# Altium schematic sheet base.SchDoc: base
size 500 x 342 mm; Date: 2019/4/19 20:09:35; SheetNumber: 1
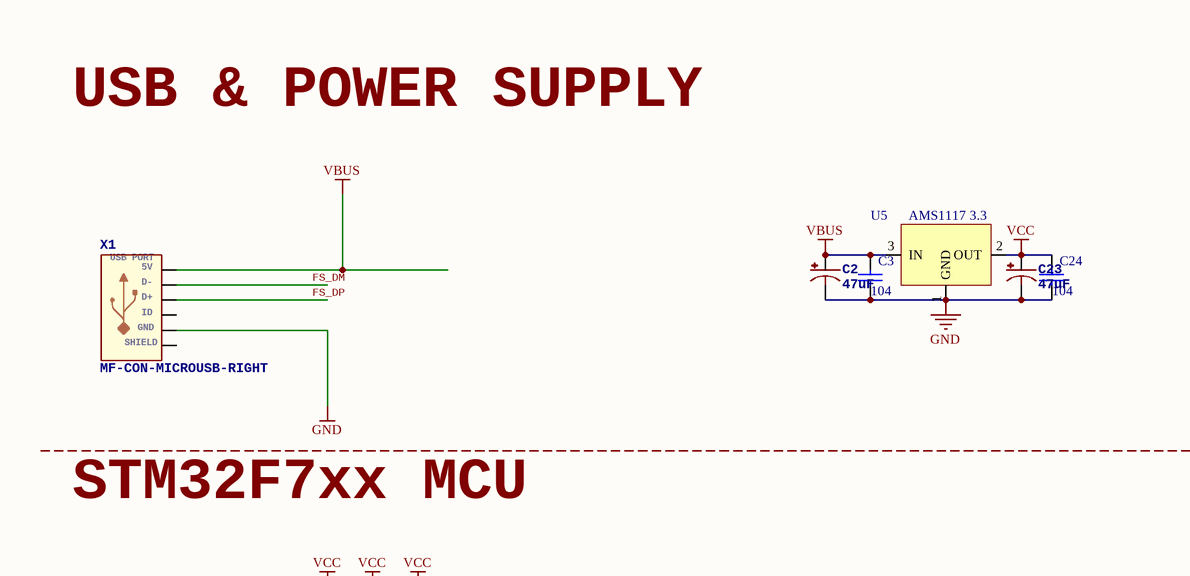
[diagram p0: base.SchDoc, top left]
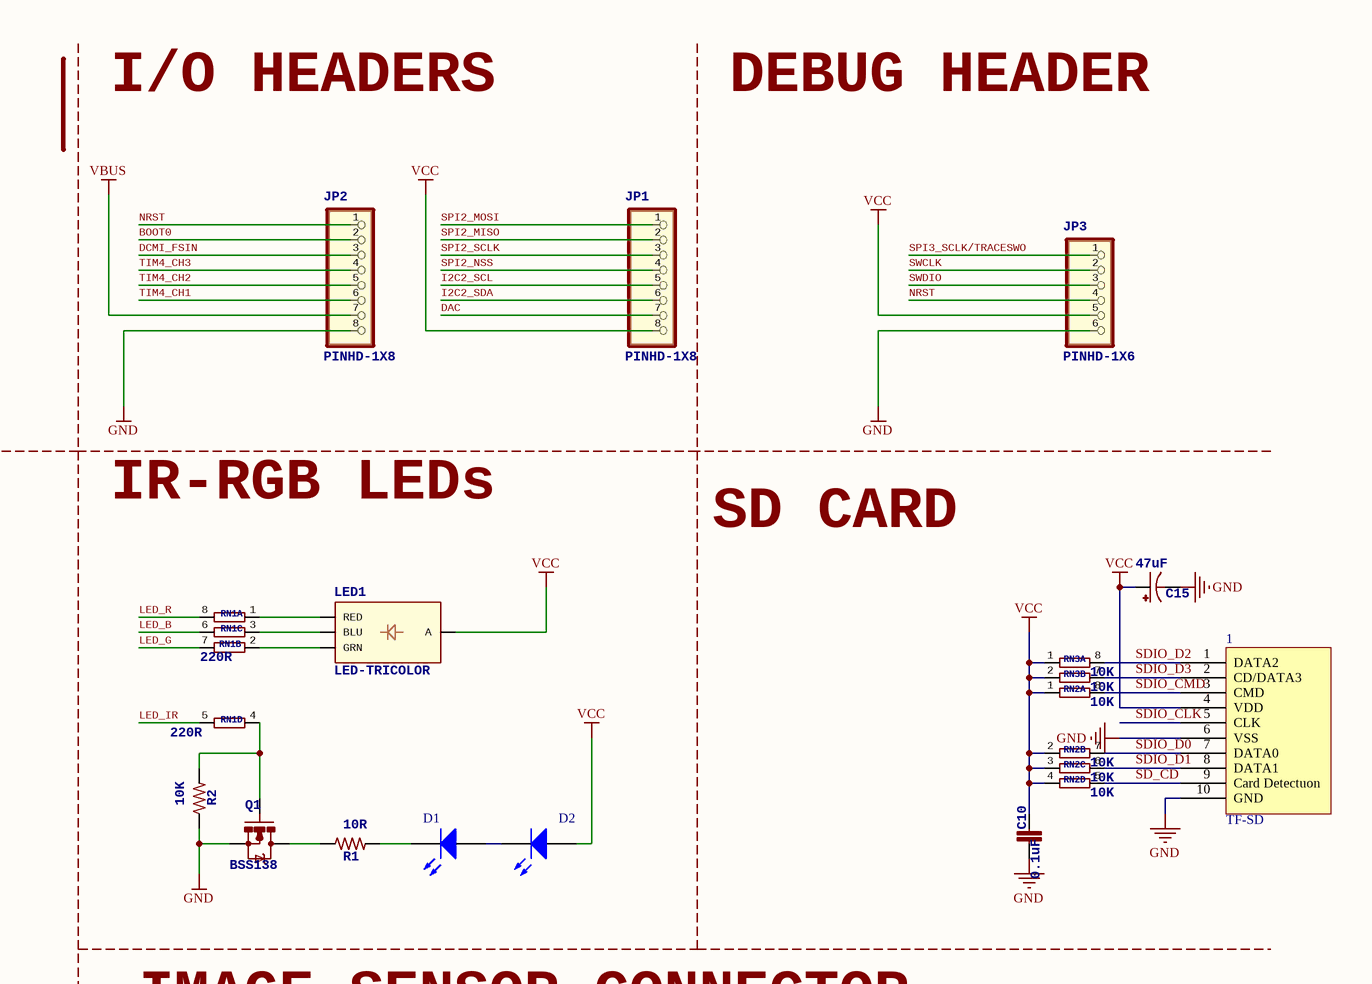
[diagram p1: base.SchDoc, top right]
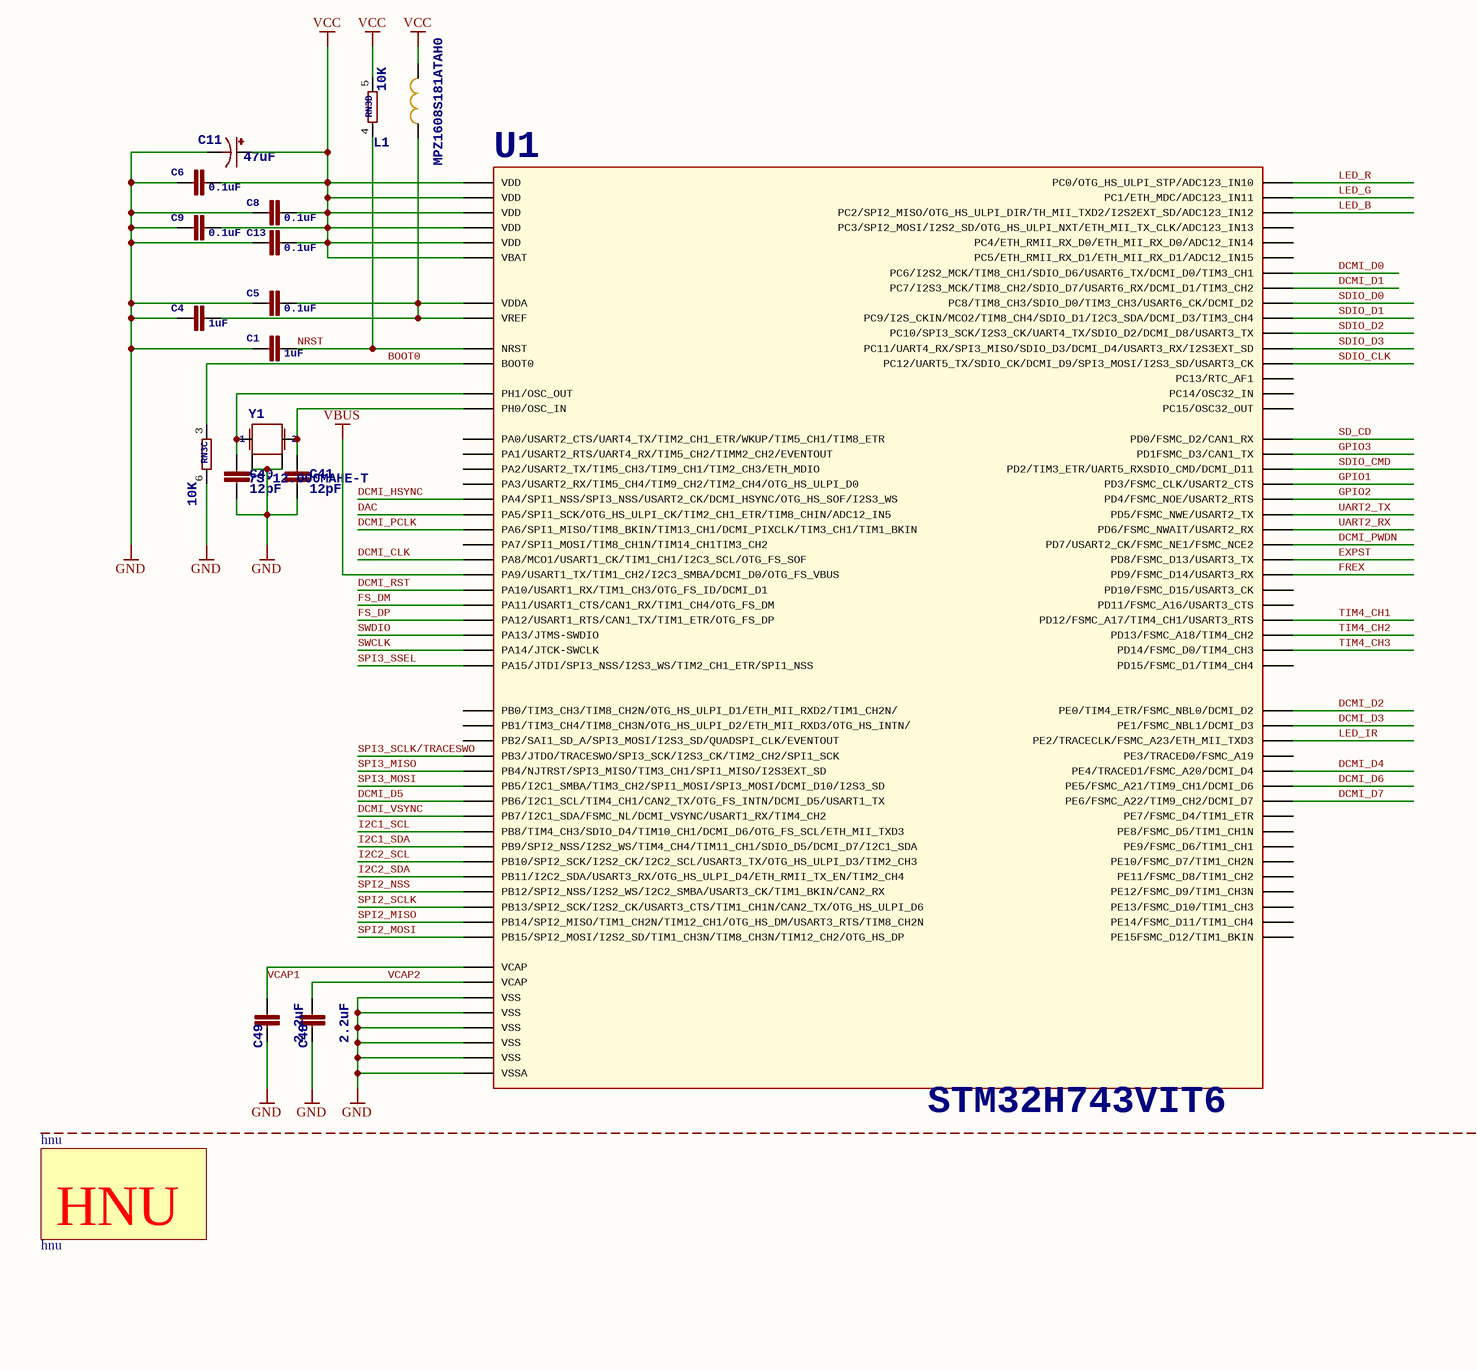
[diagram p2: base.SchDoc, bottom left]
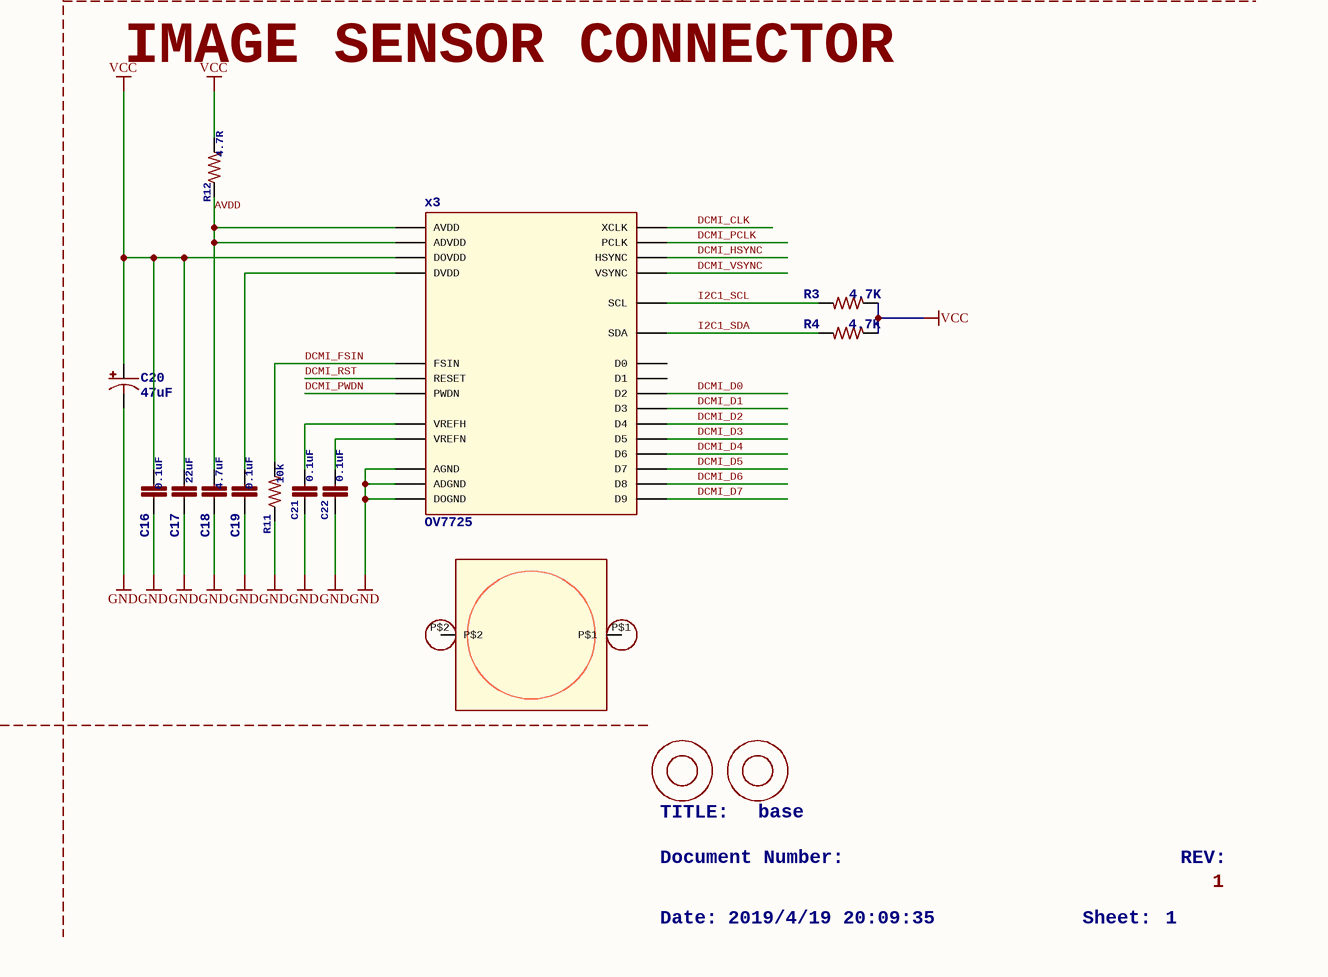
[diagram p3: base.SchDoc, bottom right]

## Parts
1  TF-SD  [TF]
C1  1uF  [0603-CAP]
C2  47uF  [EIA3216]
C3  value 104  [0603-CAP]  (hidden comment: Cap)
C4  1uF  [0603-CAP]
C5  0.1uF  [0603-CAP]
C6  0.1uF  [0603-CAP]
C8  0.1uF  [0603-CAP]
C9  0.1uF  [0603-CAP]
C10  0.1uF  [0603-CAP]
C11  47uF  [EIA3216]
C13  0.1uF  [0603-CAP]
C15  47uF  [EIA3216]
C16  0.1uF  [0603-CAP]
C17  22uF  [0603-CAP]
C18  4.7uF  [0603-CAP]
C19  0.1uF  [0603-CAP]
C20  47uF  [EIA3216]
C21  0.1uF  [0603-CAP]
C22  0.1uF  [0603-CAP]
C23  47uF  [EIA3216]
C24  value 104  [0603-CAP]  (hidden comment: Cap)
C40  12pF  [0603-CAP]
C41  12pF  [0603-CAP]
C48  2.2uF  [0603-CAP]
C49  2.2uF  [0603-CAP]
D1  LED0  [LED_0603]  (value not drawn)
D2  LED0  [LED_0603]  (value not drawn)
hnu  hnu  [HNU]
JP1  PINHD-1X8  [1X08]
JP2  PINHD-1X8  [1X08]
JP3  PINHD-1X6  [1X06]
L1  MPZ1608S181ATAH0  [0603]
LED1  LED-TRICOLOR  [rgb]
LM1  LENSMOUNT20MM  [LENSMOUNT-20MM]  (value not drawn)
M1  9774030243R  [2,8-PAD]  (value not drawn)
M2  9774030243R  [2,8-PAD]  (value not drawn)
Q1  BSS138  [SOT23-3]
R1  10R  [0603-RES]
R2  10K  [0603-RES]
R3  4.7K  [0603-RES]
R4  4.7K  [0603-RES]
R11  10k  [0603-RES]
R12  4.7R  [0603-RES]
RN1  220R  [EXBV8V]  (value not drawn)  (parts A,B,C,D of 4)
RN2  10K  [EXBV8V]  (parts A,B,C,D of 4)
RN3  10K  [EXBV8V]  (parts A,B,C,D of 4)
U1  STM32H743VIT6  [LQFP100]
U5  AMS1117 3.3  [SOT_223]
X1  MF-CON-MICROUSB-RIGHT  USBPORT: USB PORT  [micro_usb]
x3  OV7725  [CSP2-28]
Y1  7S-12.000MAHE-T  [CRYSTAL-2.5X2.0]

## Nets
GND: 1.6(VSS) 1.10(GND) C1.2 C2.C(-) C3.2 C4.2 C5.2 C6.2 C8.2 C9.2 C10.2 C11.C(-) C13.2 C15.C(-) C16.2 C17.2 C18.2 C19.2 C20.C(-) C21.2 C22.2 C23.C(-) C24.2 C40.1 C41.1 C48.2 C49.2 JP2.8 JP3.6 Q1.2(S) R2.1 R11.1 RN3.6 U1.10(VSS) U1.19(VSSA) U1.26(VSS) U1.49(VSS) U1.74(VSS) U1.99(VSS) U5.1(GND) X1.5(GND) x3.B1(ADGND) x3.B4(AGND) x3.F4(DOGND) Y1.2(P$1) Y1.4(P$2)
VBUS: C2.A(+) C3.1 JP2.7 U1.68(PA9/USART1_TX/TIM1_CH2/I2C3_SMBA/DCMI_D0/OTG_FS_VBUS) U5.3(IN) X1.1(5V)
VCC: 1.4(VDD) C6.1 C8.1 C9.1 C10.1 C11.A(+) C13.1 C15.A(+) C16.1 C17.1 C20.A(+) C23.A(+) C24.1 D2.1(A) JP1.8 JP3.5 L1.2 LED1.A R3.1 R4.1 R12.2 RN2.1 RN2.2 RN2.3 RN2.4 RN3.1 RN3.2 RN3.5 U1.6(VBAT) U1.11(VDD) U1.27(VDD) U1.50(VDD) U1.75(VDD) U1.100(VDD) U5.2(OUT) x3.E5(DOVDD)
AVDD: C18.1 R12.1 x3.A1(ADVDD) x3.B3(AVDD)
BOOT0: JP2.2 RN3.3 U1.94(BOOT0)
DAC: JP1.7 U1.29(PA5/SPI1_SCK/OTG_HS_ULPI_CK/TIM2_CH1_ETR/TIM8_CHIN/ADC12_IN5)
DCMI_CLK: U1.67(PA8/MCO1/USART1_CK/TIM1_CH1/I2C3_SCL/OTG_FS_SOF) x3.F3(XCLK)
DCMI_D0: U1.63(PC6/I2S2_MCK/TIM8_CH1/SDIO_D6/USART6_TX/DCMI_D0/TIM3_CH1) x3.F5(D2)
DCMI_D1: U1.64(PC7/I2S3_MCK/TIM8_CH2/SDIO_D7/USART6_RX/DCMI_D1/TIM3_CH2) x3.F2(D3)
DCMI_D2: U1.97(PE0/TIM4_ETR/FSMC_NBL0/DCMI_D2) x3.D6(D4)
DCMI_D3: U1.98(PE1/FSMC_NBL1/DCMI_D3) x3.D1(D5)
DCMI_D4: U1.3(PE4/TRACED1/FSMC_A20/DCMI_D4) x3.E6(D6)
DCMI_D5: U1.92(PB6/I2C1_SCL/TIM4_CH1/CAN2_TX/OTG_FS_INTN/DCMI_D5/USART1_TX) x3.E1(D7)
DCMI_D6: U1.4(PE5/FSMC_A21/TIM9_CH1/DCMI_D6) x3.F6(D8)
DCMI_D7: U1.5(PE6/FSMC_A22/TIM9_CH2/DCMI_D7) x3.F1(D9)
DCMI_FSIN: JP2.3 R11.2 x3.A4(FSIN)
DCMI_HSYNC: U1.28(PA4/SPI1_NSS/SPI3_NSS/USART2_CK/DCMI_HSYNC/OTG_HS_SOF/I2S3_WS) x3.B6(HSYNC)
DCMI_PCLK: U1.30(PA6/SPI1_MISO/TIM8_BKIN/TIM13_CH1/DCMI_PIXCLK/TIM3_CH1/TIM1_BKIN) x3.E4(PCLK)
DCMI_PWDN: U1.88(PD7/USART2_CK/FSMC_NE1/FSMC_NCE2) x3.C1(PWDN)
DCMI_RST: U1.69(PA10/USART1_RX/TIM1_CH3/OTG_FS_ID/DCMI_D1) x3.A2(RESET)
DCMI_VSYNC: U1.93(PB7/I2C1_SDA/FSMC_NL/DCMI_VSYNC/USART1_RX/TIM4_CH2) x3.C6(VSYNC)
EXPST: U1.55(PD8/FSMC_D13/USART3_TX)
FREX: U1.56(PD9/FSMC_D14/USART3_RX)
FS_DM: U1.70(PA11/USART1_CTS/CAN1_RX/TIM1_CH4/OTG_FS_DM) X1.2(D-)
FS_DP: U1.71(PA12/USART1_RTS/CAN1_TX/TIM1_ETR/OTG_FS_DP) X1.3(D+)
GPIO1: U1.84(PD3/FSMC_CLK/USART2_CTS)
GPIO2: U1.85(PD4/FSMC_NOE/USART2_RTS)
GPIO3: U1.82(PD1FSMC_D3/CAN1_TX)
I2C1_SCL: R3.2 U1.95(PB8/TIM4_CH3/SDIO_D4/TIM10_CH1/DCMI_D6/OTG_FS_SCL/ETH_MII_TXD3) x3.A5(SCL)
I2C1_SDA: R4.2 U1.96(PB9/SPI2_NSS/I2S2_WS/TIM4_CH4/TIM11_CH1/SDIO_D5/DCMI_D7/I2C1_SDA) x3.B5(SDA)
I2C2_SCL: JP1.5 U1.46(PB10/SPI2_SCK/I2S2_CK/I2C2_SCL/USART3_TX/OTG_HS_ULPI_D3/TIM2_CH3)
I2C2_SDA: JP1.6 U1.47(PB11/I2C2_SDA/USART3_RX/OTG_HS_ULPI_D4/ETH_RMII_TX_EN/TIM2_CH4)
LED_B: RN1.6 U1.17(PC2/SPI2_MISO/OTG_HS_ULPI_DIR/TH_MII_TXD2/I2S2EXT_SD/ADC123_IN12)
LED_G: RN1.7 U1.16(PC1/ETH_MDC/ADC123_IN11)
LED_IR: RN1.5 U1.1(PE2/TRACECLK/FSMC_A23/ETH_MII_TXD3)
LED_R: RN1.8 U1.15(PC0/OTG_HS_ULPI_STP/ADC123_IN10)
NRST: C1.1 JP2.1 JP3.4 RN3.4 U1.14(NRST)
SD_CD: 1.9(Card_Detectuon) RN2.5 U1.81(PD0/FSMC_D2/CAN1_RX)
SDIO_CLK: 1.5(CLK) U1.80(PC12/UART5_TX/SDIO_CK/DCMI_D9/SPI3_MOSI/I2S3_SD/USART3_CK)
SDIO_CMD: 1.3(CMD) RN2.8 U1.83(PD2/TIM3_ETR/UART5_RXSDIO_CMD/DCMI_D11)
SDIO_D0: 1.7(DATA0) RN2.7 U1.65(PC8/TIM8_CH3/SDIO_D0/TIM3_CH3/USART6_CK/DCMI_D2)
SDIO_D1: 1.8(DATA1) RN2.6 U1.66(PC9/I2S_CKIN/MCO2/TIM8_CH4/SDIO_D1/I2C3_SDA/DCMI_D3/TIM3_CH4)
SDIO_D2: 1.1(DATA2) RN3.8 U1.78(PC10/SPI3_SCK/I2S3_CK/UART4_TX/SDIO_D2/DCMI_D8/USART3_TX)
SDIO_D3: 1.2(CD/DATA3) RN3.7 U1.79(PC11/UART4_RX/SPI3_MISO/SDIO_D3/DCMI_D4/USART3_RX/I2S3EXT_SD)
SPI2_MISO: JP1.2 U1.53(PB14/SPI2_MISO/TIM1_CH2N/TIM12_CH1/OTG_HS_DM/USART3_RTS/TIM8_CH2N)
SPI2_MOSI: JP1.1 U1.54(PB15/SPI2_MOSI/I2S2_SD/TIM1_CH3N/TIM8_CH3N/TIM12_CH2/OTG_HS_DP)
SPI2_NSS: JP1.4 U1.51(PB12/SPI2_NSS/I2S2_WS/I2C2_SMBA/USART3_CK/TIM1_BKIN/CAN2_RX)
SPI2_SCLK: JP1.3 U1.52(PB13/SPI2_SCK/I2S2_CK/USART3_CTS/TIM1_CH1N/CAN2_TX/OTG_HS_ULPI_D6)
SPI3_MISO: U1.90(PB4/NJTRST/SPI3_MISO/TIM3_CH1/SPI1_MISO/I2S3EXT_SD)
SPI3_MOSI: U1.91(PB5/I2C1_SMBA/TIM3_CH2/SPI1_MOSI/SPI3_MOSI/DCMI_D10/I2S3_SD)
SPI3_SCLK/TRACESWO: JP3.1 U1.89(PB3/JTDO/TRACESWO/SPI3_SCK/I2S3_CK/TIM2_CH2/SPI1_SCK)
SPI3_SSEL: U1.77(PA15/JTDI/SPI3_NSS/I2S3_WS/TIM2_CH1_ETR/SPI1_NSS)
SWCLK: JP3.2 U1.76(PA14/JTCK-SWCLK)
SWDIO: JP3.3 U1.72(PA13/JTMS-SWDIO)
TIM4_CH1: JP2.6 U1.59(PD12/FSMC_A17/TIM4_CH1/USART3_RTS)
TIM4_CH2: JP2.5 U1.60(PD13/FSMC_A18/TIM4_CH2)
TIM4_CH3: JP2.4 U1.61(PD14/FSMC_D0/TIM4_CH3)
UART2_RX: U1.87(PD6/FSMC_NWAIT/USART2_RX)
UART2_TX: U1.86(PD5/FSMC_NWE/USART2_TX)
VCAP1: C49.1 U1.48(VCAP)
VCAP2: C48.1 U1.73(VCAP)
NetC4_1: C4.1 C5.1 L1.1 U1.20(VREF) U1.21(VDDA)
NetC19_1: C19.1 x3.E3(DVDD)
NetC21_1: C21.1 x3.A3(VREFH)
NetC22_1: C22.1 x3.B2(VREFN)
NetC40_2: C40.2 U1.13(PH1/OSC_OUT) Y1.3
NetC41_2: C41.2 U1.12(PH0/OSC_IN) Y1.1
NetD1_1: D1.1(A) D2.2(K)
NetD1_2: D1.2(K) R1.2
NetLED1_B: LED1.B(BLU) RN1.3
NetLED1_G: LED1.G(GRN) RN1.2
NetLED1_R: LED1.R(RED) RN1.1
NetQ1_1: Q1.1(G) R2.2 RN1.4
NetQ1_3: Q1.3(D) R1.1

Not connected (* = marked no-connect by the designer): LM1 P$1 P$2; U1 2(PE3/TRACED0/FSMC_A19) 7(PC13/RTC_AF1) 8(PC14/OSC32_IN) 9(PC15/OSC32_OUT) 18(PC3/SPI2_MOSI/I2S2_SD/OTG_HS_ULPI_NXT/ETH_MII_TX_CLK/ADC123_IN13) 22(PA0/USART2_CTS/UART4_TX/TIM2_CH1_ETR/WKUP/TIM5_CH1/TIM8_ETR) 23(PA1/USART2_RTS/UART4_RX/TIM5_CH2/TIMM2_CH2/EVENTOUT) 24(PA2/USART2_TX/TIM5_CH3/TIM9_CH1/TIM2_CH3/ETH_MDIO) 25(PA3/USART2_RX/TIM5_CH4/TIM9_CH2/TIM2_CH4/OTG_HS_ULPI_D0) 31(PA7/SPI1_MOSI/TIM8_CH1N/TIM14_CH1TIM3_CH2) 32(PC4/ETH_RMII_RX_D0/ETH_MII_RX_D0/ADC12_IN14) 33(PC5/ETH_RMII_RX_D1/ETH_MII_RX_D1/ADC12_IN15) 34(PB0/TIM3_CH3/TIM8_CH2N/OTG_HS_ULPI_D1/ETH_MII_RXD2/TIM1_CH2N/) 35(PB1/TIM3_CH4/TIM8_CH3N/OTG_HS_ULPI_D2/ETH_MII_RXD3/OTG_HS_INTN/) 36(PB2/SAI1_SD_A/SPI3_MOSI/I2S3_SD/QUADSPI_CLK/EVENTOUT) 37(PE7/FSMC_D4/TIM1_ETR) 38(PE8/FSMC_D5/TIM1_CH1N) 39(PE9/FSMC_D6/TIM1_CH1) 40(PE10/FSMC_D7/TIM1_CH2N) 41(PE11/FSMC_D8/TIM1_CH2) 42(PE12/FSMC_D9/TIM1_CH3N) 43(PE13/FSMC_D10/TIM1_CH3) 44(PE14/FSMC_D11/TIM1_CH4) 45(PE15FSMC_D12/TIM1_BKIN) 57(PD10/FSMC_D15/USART3_CK) 58(PD11/FSMC_A16/USART3_CTS) 62(PD15/FSMC_D1/TIM4_CH4); X1 4(ID) S1 S2 S3 S4 S5 S6(SLD); x3 A6(D0) E2(D1)

## Notes on the sheet
- I/O HEADERS
- DEBUG HEADER
- USB & POWER SUPPLY
- STM32F7xx MCU
- IR-RGB LEDs
- SD CARD
- IMAGE SENSOR CONNECTOR
- TITLE:
- Document Number:
- (near M1) base
- REV:
- 1
- Date:
- 2019/4/19 20:09:35
- Sheet:
- (in symbol hnu) HNU

## Library data of the parts
C1 C4-C6 C8-C10 C13 C16 C18 C19 C21 C22 C40 C41 C48 C49 = CAP0603-CAP: CapacitorStandard 0603 ceramic capacitor, and 0.1" leaded capacitor.
C2 C11 C15 C20 C23 = CAP_POL1206: Capacitor PolarizedThese are standard SMD and PTH capacitors. Normally 10uF, 47uF, and 100uF in electrolytic and tantalum varieties. Always verify the external diameter of the through hole cap, it varies with capacity, voltage, and manufacturer. The EIA devices should be standard.
C3 C24 = Cap: Capacitor; Published: 8-Jun-2000; LatestRevisionDate: 17-Jul-2002; LatestRevisionNote: Re-released for DXP Platform.; PackageReference: RAD-0.3; Publisher: Altium Limited; PackageDescription: Radial Cap, Thru-Hole; 2 Leads; 0.3 in Pin Spacing
C17 = CAP0805: CapacitorStandard 0603 ceramic capacitor, and 0.1" leaded capacitor.
D1 D2 = LED0: Typical INFRARED GaAs LED; Published: 8-Jun-2000; LatestRevisionDate: 08-Jul-2005; LatestRevisionNote: Mech Layer 1 removed.; PackageReference: LED-0; Publisher: Altium Limited; PackageDescription: LED; 2 Leads
JP1 JP2 = PINHD-1X8: PIN HEADER
JP3 = PINHD-1X6: PIN HEADER
L1 = INDUCTOR0603: InductorsBasic Inductor/Choke - 0603 and 1206. Footprints are not proven and vary greatly between part numbers.
LED1 = LED-TRICOLOR: Tri-Color LED SMDProven layout and schematic for triple color LED in SMD package - common anode. Spark Fun Electronics SKU : COM-07844
M1 M2 = 9774030151R
Q1 = MOSFET-NCHANNELSMD
R1-R4 R11 R12 = RESISTOR0603-RES: ResistorBasic schematic elements and footprints for 0603, 1206, and PTH resistors.
RN1-RN3 = 4R-NEXBV8V: Array Chip Resistor   Source: RS Component / Phycomp; OC_FARNELL: unknown; OC_NEWARK: unknown
U1 = STM32F746LQFP100
U5 = AMS1117
X1 = USB_MICRO_RIGHT: Library:  MF_Connectors Description: 5 Pin USB Connectors. SLD is the shield connection. Usually tied to ground through a small ferrite bead.; 5V: 5V; D-: D-; D+: D+; ID: ID; GND: GND; SHIELD: SHIELD
Y1 = CRYSTAL2.5X2.0: CrystalsVarious standard crystals. Proven footprints. Spark Fun Electronics SKU : COM-00534; 1: 1; 2: 2